# Altium project Triacs.PrjPcb
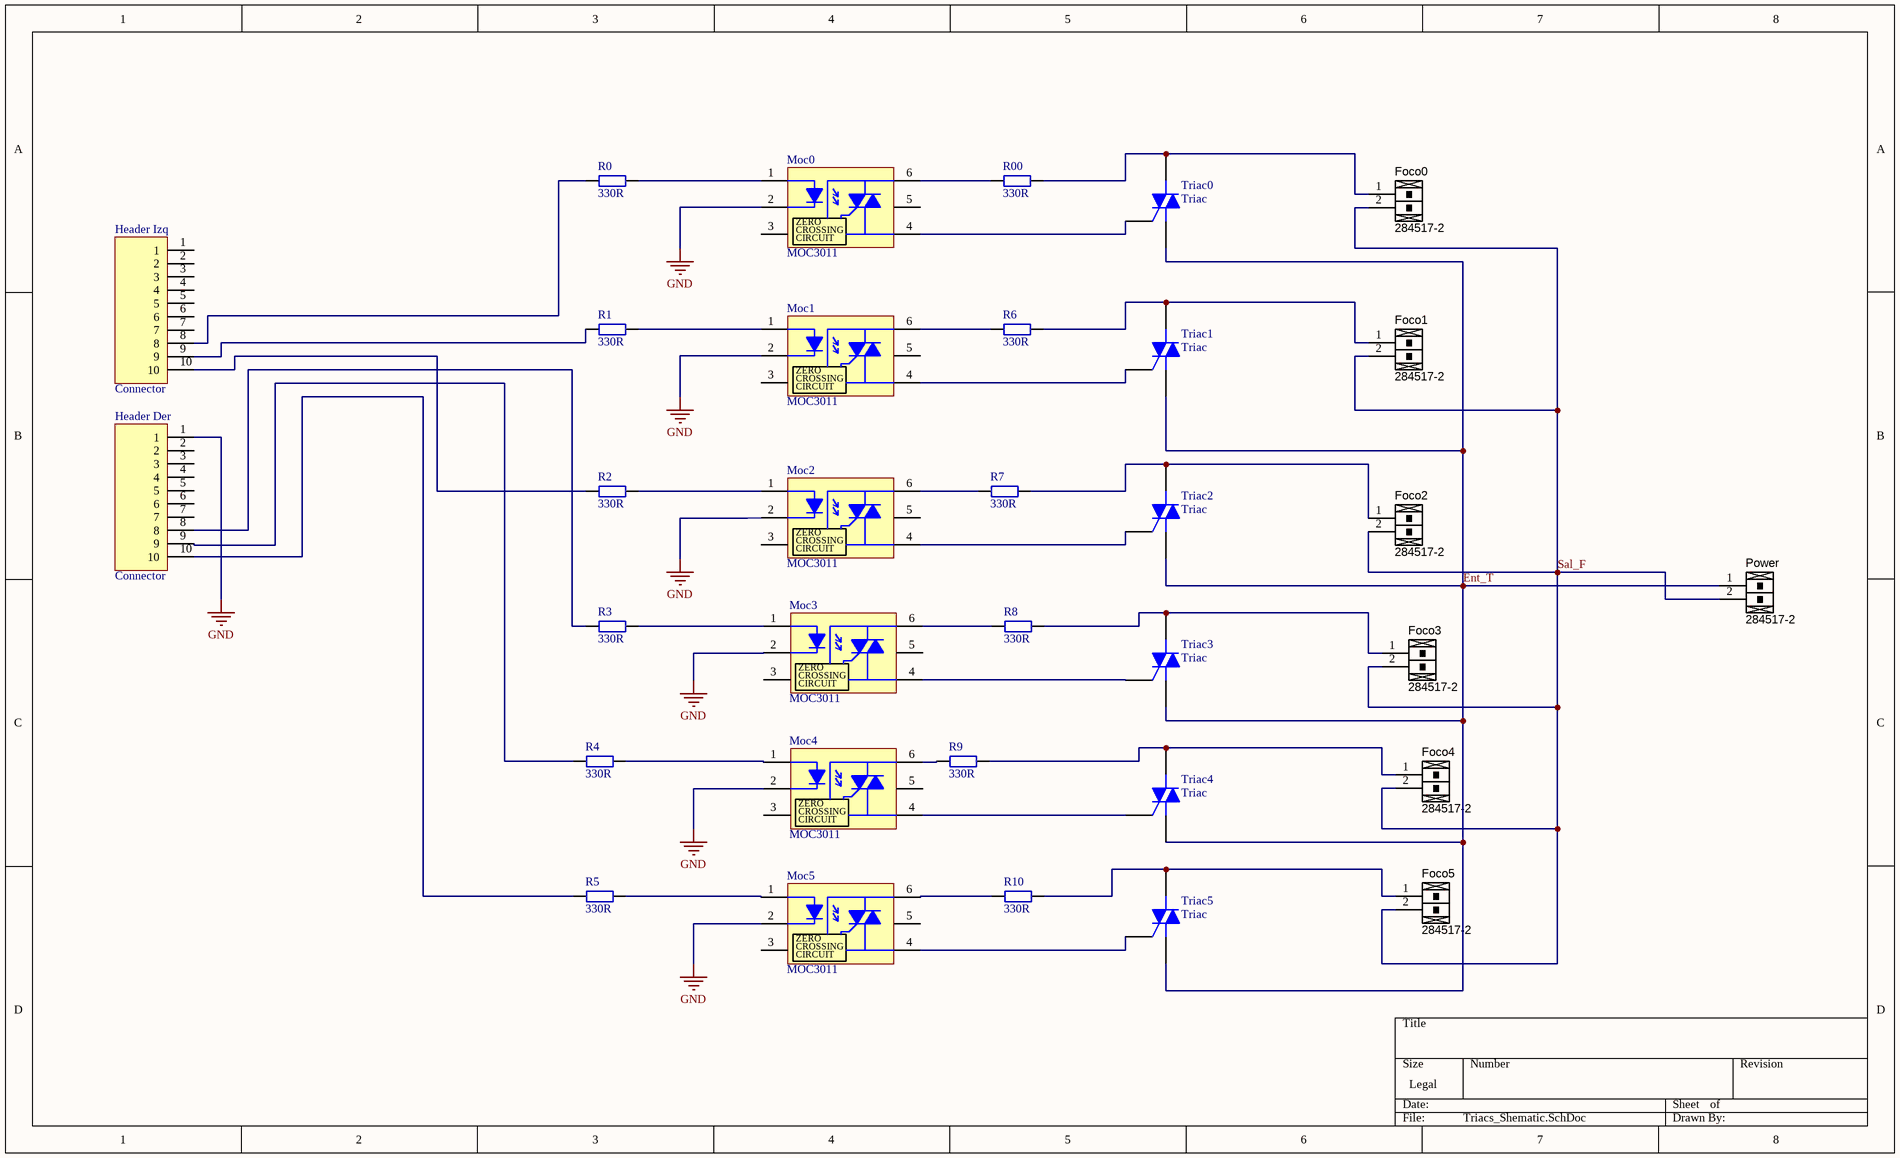
[diagram p0: Triacs_Shematic.SchDoc]
1 sheet, 33 parts. Net scope: global (net labels, ports and power ports of the same name join across sheets).
Board file: Triacs.PcbDoc

## Sheet Triacs_Shematic.SchDoc
size Legal

### Parts
Foco0  Manufacturer Part Number 1: 284517-2  [2P_PCB_TERM_BLOCK_HDR]  (hidden comment: 2P_TERM_BLOCK_HEADER)
Foco1  Manufacturer Part Number 1: 284517-2  [2P_PCB_TERM_BLOCK_HDR]  (hidden comment: 2P_TERM_BLOCK_HEADER)
Foco2  Manufacturer Part Number 1: 284517-2  [2P_PCB_TERM_BLOCK_HDR]  (hidden comment: 2P_TERM_BLOCK_HEADER)
Foco3  Manufacturer Part Number 1: 284517-2  [2P_PCB_TERM_BLOCK_HDR]  (hidden comment: 2P_TERM_BLOCK_HEADER)
Foco4  Manufacturer Part Number 1: 284517-2  [2P_PCB_TERM_BLOCK_HDR]  (hidden comment: 2P_TERM_BLOCK_HEADER)
Foco5  Manufacturer Part Number 1: 284517-2  [2P_PCB_TERM_BLOCK_HDR]  (hidden comment: 2P_TERM_BLOCK_HEADER)
Header_Der  Connector  [1x10x2.54 Pin Header TH V]
Header_Izq  Connector  [1x10x2.54 Pin Header TH V]
Moc0  MOC3011  [PDIP6-300-W]
Moc1  MOC3011  [PDIP6-300-W]
Moc2  MOC3011  [PDIP6-300-W]
Moc3  MOC3011  [PDIP6-300-W]
Moc4  MOC3011  [PDIP6-300-W]
Moc5  MOC3011  [PDIP6-300-W]
Power  Manufacturer Part Number 1: 284517-2  [2P_PCB_TERM_BLOCK_HDR]  (hidden comment: 2P_TERM_BLOCK_HEADER)
R0  330R  [R Axial 0.4]
R00  330R  [R Axial 0.4]
R1  330R  [R Axial 0.4]
R2  330R  [R Axial 0.4]
R3  330R  [R Axial 0.4]
R4  330R  [R Axial 0.4]
R5  330R  [R Axial 0.4]
R6  330R  [R Axial 0.4]
R7  330R  [R Axial 0.4]
R8  330R  [R Axial 0.4]
R9  330R  [R Axial 0.4]
R10  330R  [R Axial 0.4]
Triac0  Triac  [369-03]
Triac1  Triac  [369-03]
Triac2  Triac  [369-03]
Triac3  Triac  [369-03]
Triac4  Triac  [369-03]
Triac5  Triac  [369-03]

### Nets
GND: Header_Der.1 Moc0.2 Moc1.2 Moc2.2 Moc3.2 Moc4.2 Moc5.2
Ent_T: Power.1 Triac0.1(M1) Triac1.1(M1) Triac2.1(M1) Triac3.1(M1) Triac4.1(M1) Triac5.1(M1)
Sal_F: Foco0.2 Foco1.2 Foco2.2 Foco3.2 Foco4.2 Foco5.2 Power.2
NetFoco0_1: Foco0.1 R00.2 Triac0.2(M2)
NetFoco1_1: Foco1.1 R6.2 Triac1.2(M2)
NetFoco2_1: Foco2.1 R7.2 Triac2.2(M2)
NetFoco3_1: Foco3.1 R8.2 Triac3.2(M2)
NetFoco4_1: Foco4.1 R9.2 Triac4.2(M2)
NetFoco5_1: Foco5.1 R10.2 Triac5.2(M2)
NetHeader_Der_8: Header_Der.8 R3.1
NetHeader_Der_9: Header_Der.9 R4.1
NetHeader_Der_10: Header_Der.10 R5.1
NetHeader_Izq_8: Header_Izq.8 R0.1
NetHeader_Izq_9: Header_Izq.9 R1.1
NetHeader_Izq_10: Header_Izq.10 R2.1
NetMoc0_1: Moc0.1 R0.2
NetMoc0_4: Moc0.4 Triac0.3(G)
NetMoc0_6: Moc0.6 R00.1
NetMoc1_1: Moc1.1 R1.2
NetMoc1_4: Moc1.4 Triac1.3(G)
NetMoc1_6: Moc1.6 R6.1
NetMoc2_1: Moc2.1 R2.2
NetMoc2_4: Moc2.4 Triac2.3(G)
NetMoc2_6: Moc2.6 R7.1
NetMoc3_1: Moc3.1 R3.2
NetMoc3_4: Moc3.4 Triac3.3(G)
NetMoc3_6: Moc3.6 R8.1
NetMoc4_1: Moc4.1 R4.2
NetMoc4_4: Moc4.4 Triac4.3(G)
NetMoc4_6: Moc4.6 R9.1
NetMoc5_1: Moc5.1 R5.2
NetMoc5_4: Moc5.4 Triac5.3(G)
NetMoc5_6: Moc5.6 R10.1

Not connected (* = marked no-connect by the designer): Header_Der 2 3 4 5 6 7; Header_Izq 1 2 3 4 5 6 7; Moc0 3 5; Moc1 3 5; Moc2 3 5; Moc3 3 5; Moc4 3 5; Moc5 3 5

### Notes on the sheet
- (in symbol MOC3041M) ZERO; CROSSING; CIRCUIT

### Library data of the parts
Foco0-Foco5 Power = 2P_TERM_BLOCK_HEADER: Terminal Block THT 2-position header 3.81mm pitch; Manufacturer 1: TE Connectivity; Pitch: 0.150" (3.81mm); Voltage: 300V; Positions Per Level: 2; Mating Connector: 284507-2; SCDType: undef; Category: Connectors; Mounting Type: Through Hole; Terminal Block Type: Header, Male Pins, Right-angle, Shrouded (4 Side); Package / Case: Header; 3.81mm pitch; Supplier 1: Digi-Key; Supplier Part Number 1: A98410-ND
Header_Der Header_Izq = Header 1x10
Moc0-Moc5 = MOC3041M: Triac & SCR Output Optocouplers DIP-6 ZERO TRIAC; Manufacturer: Fairchild Semiconductor; Isolation Voltage: 5250 Vrms; Output Device: PhotoTriac; Output Type: AC; Forward Current: 60 mA; Forward Voltage: 1.25 V; Power Dissipation: 250 mW; Maximum Trigger Current: 15 mA; Number of Channels per Chip: 1 Channel; Off-state Output Voltage - VDRM: 400 V; Zero-Crossing Circuit: With Zero-Crossing Circuit; Zero-Crossing Voltage: 20 V; Supplier 1: Mouser; Manufacturer Part Number: MOC3041M; RoHS: RoHS Compliant; Category: Triac & SCR Output Optocouplers; Stock 1: 3450; Pricing 1: 1=0.672, 10=0.520, 100=0.336, 1000=0.269, 5000=0.226, 10000=0.218, 25000=0.210, 50000=0.206 (EUR); Package/Case: PDIP-6; Packaging: Bulk; Series: MOC3041M; Brand: Fairchild Semiconductor; Maximum Operating Temperature: + 85 C; Minimum Operating Temperature: - 40 C; Standard Pack Qty: 1000; RoHS - Mouser: Y; Minimum Order Quantity: 1; Reeling: False; ComponentLink1URL: http://www.mouser.com/ds/2/149/MOC3041M-195885.pdf; ComponentLink1Description: http://www.mouser.com/ds/2/149/MOC3041M-195885.pdf
R0 R00-R10 = R: Resistor, generic
Triac0-Triac5 = Triac: Silicon Bidirectional Triode Thyristor; Note: Pin 2 is electrically connected to Pin 4 (TAB); Published: 29-Sep-2000; LatestRevisionDate: 17-Jul-2002; LatestRevisionNote: Re-released for DXP Platform.; DatasheetVersion: 1999; PackageReference: 369-03; Publisher: Altium Limited; PackageDescription: TO, Thru-Hole, Vertical, Heatsink Mounted; 3 In-Line Leads; Pitch 2.28 mm; ComponentLink1Description: Manufacturer Link; ComponentLink1URL: http://www.motorola.com/